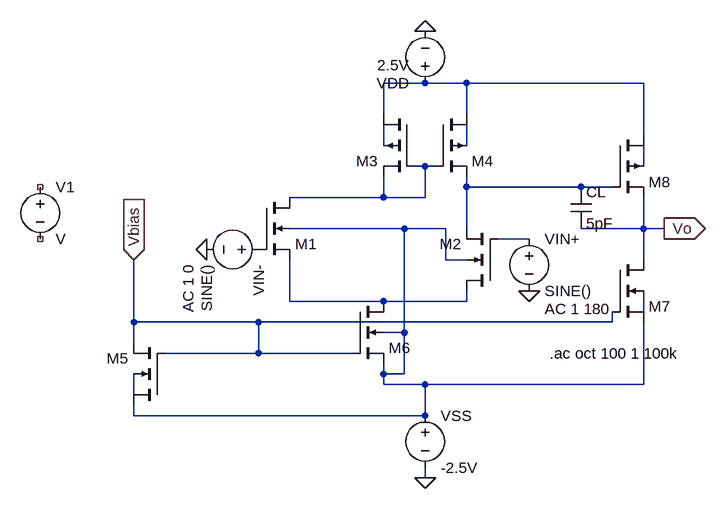
[diagram p0: schematic LAB2_Jiayi_Feng_2288941F.asc]
LAB2_Jiayi_Feng_2288941F.asc, the LTspice schematic file:
Version 4
SHEET 1 908 708
WIRE 304 -80 240 -80
WIRE 368 -80 304 -80
WIRE 640 -80 368 -80
WIRE 240 -32 240 -80
WIRE 368 -32 368 -80
WIRE 640 0 640 -80
WIRE 240 16 240 -16
WIRE 368 16 368 -16
WIRE 304 48 288 48
WIRE 320 48 304 48
WIRE 640 48 640 16
WIRE 368 80 368 64
WIRE 544 80 368 80
WIRE 592 80 544 80
WIRE 240 96 240 64
WIRE 240 96 96 96
WIRE 304 96 304 48
WIRE 304 96 240 96
WIRE 272 144 96 144
WIRE 336 144 272 144
WIRE 368 144 368 80
WIRE 640 144 640 96
WIRE 640 144 544 144
WIRE 672 144 640 144
WIRE 464 160 416 160
WIRE 336 192 336 144
WIRE 368 192 336 192
WIRE 640 192 640 144
WIRE 96 256 96 192
WIRE 240 256 96 256
WIRE 368 256 368 240
WIRE 368 256 240 256
WIRE 640 272 640 240
WIRE -144 288 -144 192
WIRE 48 288 -144 288
WIRE 592 288 592 272
WIRE 592 288 48 288
WIRE 272 304 272 144
WIRE 272 304 240 304
WIRE -144 320 -144 288
WIRE 48 336 48 288
WIRE 48 336 -96 336
WIRE 192 336 48 336
WIRE 240 368 240 352
WIRE 272 368 272 304
WIRE 272 368 240 368
WIRE 240 384 240 368
WIRE 304 384 240 384
WIRE 640 384 640 288
WIRE 640 384 304 384
WIRE -144 400 -144 368
WIRE -144 432 -144 416
WIRE 304 432 304 384
WIRE 304 432 -144 432
WIRE 304 528 304 512
FLAG 304 528 0
FLAG -32 176 0
FLAG 304 -160 0
FLAG 464 240 0
FLAG 672 144 Vo
IOPIN 672 144 Out
FLAG -144 192 Vbias
IOPIN -144 192 In
SYMBOL cap 528 80 R0
SYMATTR InstName CL
SYMATTR Value 5pF
SYMBOL voltage 304 -64 R180
WINDOW 3 24 44 Left 2
WINDOW 123 0 0 Left 2
WINDOW 39 0 0 Left 2
SYMATTR Value 2.5V
SYMATTR InstName VDD
SYMBOL voltage 304 416 R0
WINDOW 123 0 0 Left 2
WINDOW 39 0 0 Left 2
SYMATTR InstName VSS
SYMATTR Value -2.5V
SYMBOL voltage 64 176 R90
WINDOW 123 24 124 Left 2
WINDOW 39 0 0 Left 2
SYMATTR Value2 AC 1 0
SYMATTR InstName VIN-
SYMATTR Value SINE()
SYMBOL voltage 464 144 R0
WINDOW 123 24 124 Left 2
WINDOW 39 0 0 Left 2
SYMATTR Value2 AC 1 180
SYMATTR InstName VIN+
SYMATTR Value SINE()
SYMBOL pmos4 288 -32 M0
WINDOW 0 56 32 Invisible 2
SYMATTR InstName M5
SYMATTR Value M3
SYMATTR Value2 l=600n w=19.2u
SYMBOL pmos4 320 -32 R0
WINDOW 0 56 32 Invisible 2
SYMATTR InstName M1
SYMATTR Value M4
SYMATTR Value2 l=600n w=19.2u
SYMBOL nmos4 48 96 R0
WINDOW 0 56 32 Invisible 2
SYMATTR InstName M2
SYMATTR Value M1
SYMATTR Value2 l=600n w=9.6u
SYMBOL nmos4 416 240 R180
WINDOW 0 56 32 Invisible 2
SYMATTR InstName M3
SYMATTR Value M2
SYMATTR Value2 l=600n w=9.6u
SYMBOL voltage -288 64 R0
SYMATTR InstName V1
SYMBOL nmos4 -96 416 R180
WINDOW 0 56 32 Invisible 2
SYMATTR InstName M4
SYMATTR Value M5
SYMATTR Value2 l=600n w=4.8u
SYMBOL nmos4 192 256 R0
WINDOW 0 56 32 Invisible 2
SYMATTR InstName M9
SYMATTR Value M6
SYMATTR Value2 l=600n w=9.6u
SYMBOL nmos4 592 192 R0
WINDOW 0 56 32 Invisible 2
SYMATTR InstName M6
SYMATTR Value M7
SYMATTR Value2 l=600n w=19.2u
SYMBOL pmos4 592 0 R0
WINDOW 0 56 32 Invisible 2
SYMATTR InstName M7
SYMATTR Value M8
SYMATTR Value2 l=600n w=76.8u
TEXT 496 336 Left 2 !.ac oct 100 1 100k

The netlist it stands for:
* LAB2_Jiayi_Feng_2288941F.asc
CL N006 Vo 5pF
VDD N001 0 2.5V
VSS N007 0 -2.5V
VIN- P001 0 SINE() AC 1 0
VIN+ N008 0 SINE() AC 1 180
M5 N001 N004 N004 N002 M3 l=600n w=19.2u
M1 N001 N004 N006 N003 M4 l=600n w=19.2u
M2 N004 P001 N009 N007 M1 l=600n w=9.6u
M3 N009 N008 N006 N007 M2 l=600n w=9.6u
V1 NC_01 NC_02 V
M4 N007 Vbias Vbias N011 M5 l=600n w=4.8u
M9 N009 Vbias N007 N007 M6 l=600n w=9.6u
M6 Vo Vbias N007 N010 M7 l=600n w=19.2u
M7 N001 N006 Vo N005 M8 l=600n w=76.8u
.model NMOS NMOS
.model PMOS PMOS
.lib standard.mos
.ac oct 100 1 100k
.backanno
.end